# Altium project UZ_D_Inverter_Template.PrjPCB
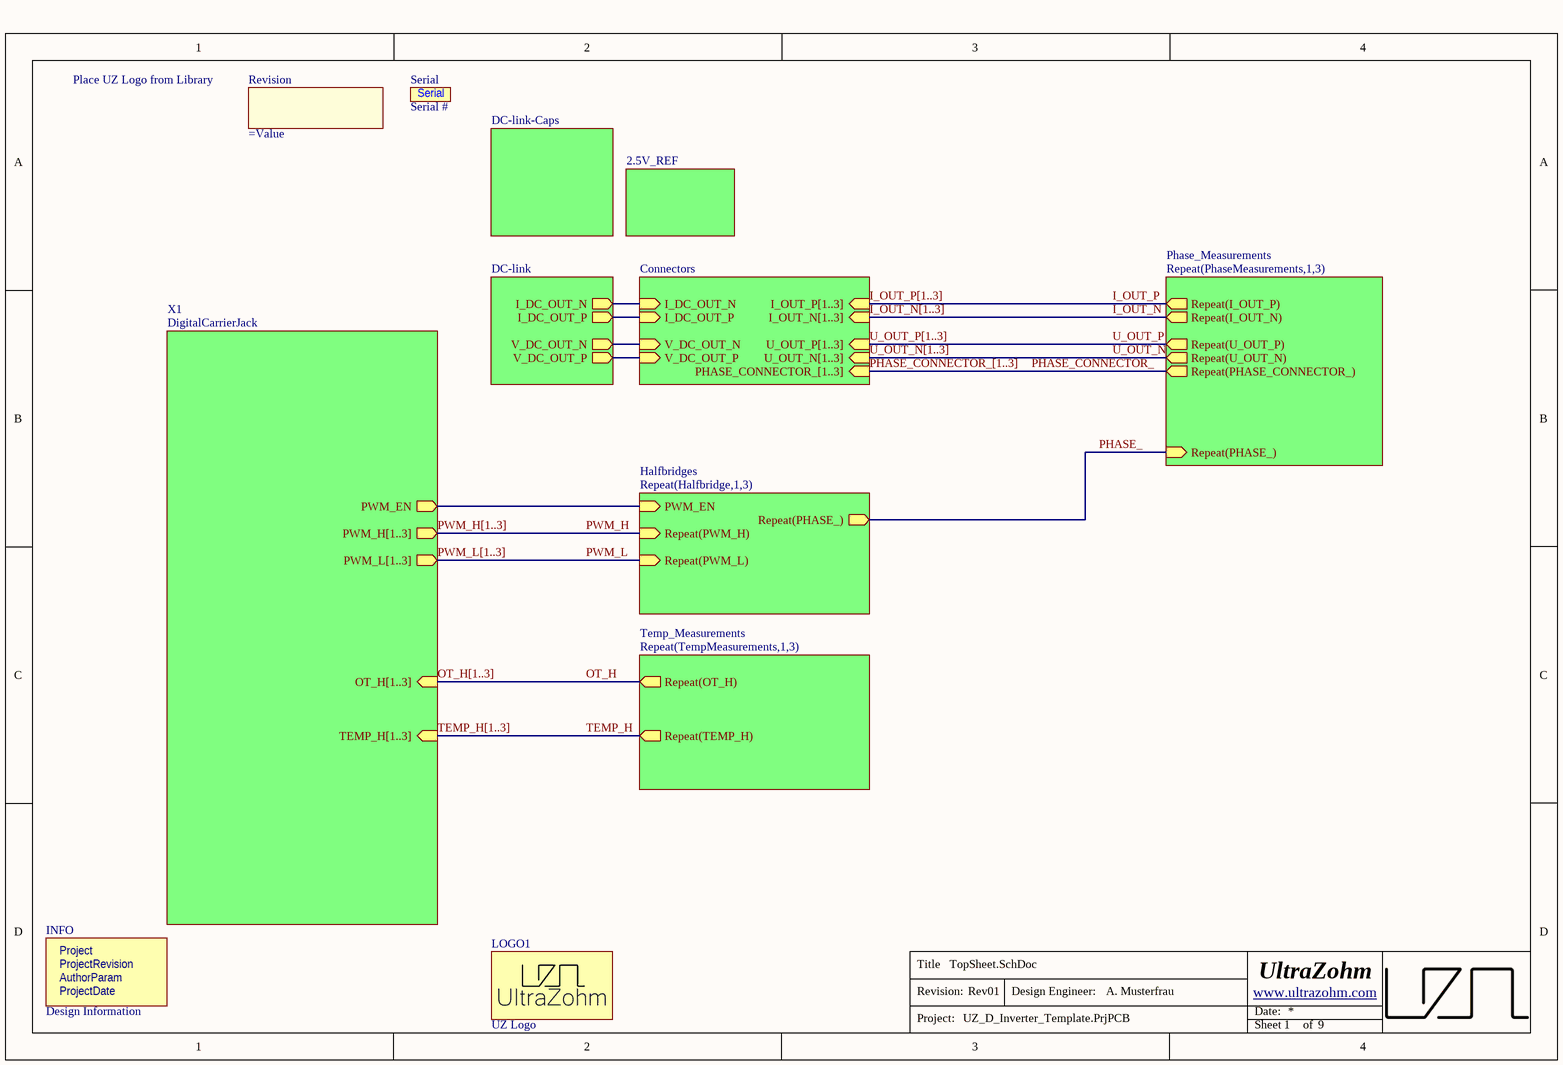
[diagram p0: TopSheet.SchDoc]
Author: A. Musterfrau; AuthorParam: A. Musterfrau; Date: 11/2019; ProjectNameCustom: UZ_D_Inverter_Template; ProjectRevision: Rev01
3 sheets, 45 parts. Net scope: hierarchical (ports join the sheet entries above them; power ports are global).
Board file: UZ_D_Inverter_Template.PcbDoc
Sheets:
  TopSheet.SchDoc
    X1 = DigitalCarrierJack.SchDoc
     = Connectors.SchDoc

## Sheet TopSheet.SchDoc
size A4; Author: A. Musterfrau; CompanyName: Technische Hochschule Nürnberg Georg Simon Ohm; Organization: UltraZohm; Address1: Kesslerplatz 12; Address2: 90489 Nürnberg; Address3: GERMANY; SheetNumber: 1; SheetTotal: 9; Website: www.ultrazohm.com

### Parts
INFO  Design Information  [Design_info]  (no BOM)
LOGO1  UZ Logo  [UZ_Logo_small]  (no BOM)
Revision  (no value)  [Designator:comment]  (no BOM)
Serial  Serial #  [SERIAL]  (no BOM)

### Sub-sheets
2.5V_REF = 2.5V_REF (file not in this document): no entries
Repeat(Halfbridge,1,3) = Halfbridges (file not in this document): Repeat(PWM_H) (in), Repeat(PWM_L) (in), Repeat(PHASE_) (out), PWM_EN (in)
Repeat(PhaseMeasurements,1,3) = Phase_Measurements (file not in this document): Repeat(I_OUT_P) (out), Repeat(I_OUT_N) (out), Repeat(U_OUT_P) (out), Repeat(U_OUT_N) (out), Repeat(PHASE_CONNECTOR_) (out), Repeat(PHASE_) (in)
Repeat(TempMeasurements,1,3) = Temp_Measurements (file not in this document): Repeat(OT_H) (out), Repeat(TEMP_H) (out)
X1 = DigitalCarrierJack: PWM_H[1..3] (out), PWM_L[1..3] (out), OT_H[1..3] (in), TEMP_H[1..3] (in), PWM_EN (out)
? = Connectors: I_DC_OUT_N (in), I_DC_OUT_P (in), I_OUT_P[1..3] (in), I_OUT_N[1..3] (in), U_OUT_P[1..3] (in), U_OUT_N[1..3] (in), V_DC_OUT_N (in), V_DC_OUT_P (in), PHASE_CONNECTOR_[1..3] (in)
? = DC-link (file not in this document): I_DC_OUT_N (out), I_DC_OUT_P (out), V_DC_OUT_N (out), V_DC_OUT_P (out)
? = DC-link-Caps (file not in this document): no entries

### Nets
I_DC_OUT_N: sheet /I_DC_OUT_N, sheet /I_DC_OUT_N
I_DC_OUT_P: sheet /I_DC_OUT_P, sheet /I_DC_OUT_P
I_OUT_N: sheet Repeat(PhaseMeasurements,1,3)/Repeat(I_OUT_N)
I_OUT_P: sheet Repeat(PhaseMeasurements,1,3)/Repeat(I_OUT_P)
OT_H: sheet Repeat(TempMeasurements,1,3)/Repeat(OT_H)
PHASE_: sheet Repeat(PhaseMeasurements,1,3)/Repeat(PHASE_), sheet Repeat(Halfbridge,1,3)/Repeat(PHASE_)
PHASE_CONNECTOR_: sheet Repeat(PhaseMeasurements,1,3)/Repeat(PHASE_CONNECTOR_)
PWM_EN: sheet X1/PWM_EN, sheet Repeat(Halfbridge,1,3)/PWM_EN
PWM_H: sheet Repeat(Halfbridge,1,3)/Repeat(PWM_H)
PWM_L: sheet Repeat(Halfbridge,1,3)/Repeat(PWM_L)
TEMP_H: sheet Repeat(TempMeasurements,1,3)/Repeat(TEMP_H)
U_OUT_N: sheet Repeat(PhaseMeasurements,1,3)/Repeat(U_OUT_N)
U_OUT_P: sheet Repeat(PhaseMeasurements,1,3)/Repeat(U_OUT_P)
V_DC_OUT_N: sheet /V_DC_OUT_N, sheet /V_DC_OUT_N
V_DC_OUT_P: sheet /V_DC_OUT_P, sheet /V_DC_OUT_P

### Buses and harness runs
bus I_OUT_N[1..3] = sheet /I_OUT_N[1..3]
bus I_OUT_P[1..3] = sheet /I_OUT_P[1..3]
bus OT_H[1..3] = sheet X1/OT_H[1..3]
bus PHASE_CONNECTOR_[1..3] = sheet /PHASE_CONNECTOR_[1..3]
bus PWM_H[1..3] = sheet X1/PWM_H[1..3]
bus PWM_L[1..3] = sheet X1/PWM_L[1..3]
bus TEMP_H[1..3] = sheet X1/TEMP_H[1..3]
bus U_OUT_N[1..3] = sheet /U_OUT_N[1..3]
bus U_OUT_P[1..3] = sheet /U_OUT_P[1..3]

### Notes on the sheet
- (near Revision) Place UZ Logo from Library
- Title
- Revision:
- Design Engineer:
- Date:
- Project:
- Sheet
- of
- (in symbol Design Information) Project; ProjectRevision; AuthorParam; ProjectDate

### Library data of the parts
INFO = Design Information: Manufacturer: UltraZohm; Created from: MGremer; Manufacturer Part Number: Design Information; PartID: 12; Created On: 03.11.2021 09:04:23; ComponentLink1Description: https://docs.ultrazohm.com/; ComponentLink1URL: homepage; Component Type: Design Information; Last Updated: 03.11.2021 09:28:34; Supplier 1: -; Supplier Part Number 1: -; Type: Design Information; Value: Design Information; Live Cycle Status: 1
LOGO1 = Logo small: Manufacturer: UltraZohm; Created from: MGremer; Created: Jan2021_Liegmann; Value: Logo; Manufacturer Part Number: Logo small; PartID: 10; Created On: 03.11.2021 09:04:23; ComponentLink1Description: https://docs.ultrazohm.com/; ComponentLink1URL: homepage; Component Type: Logo; Last Updated: 03.11.2021 09:05:50; Supplier 1: -; Supplier Part Number 1: -; Type: Logo; Live Cycle Status: 1
Revision = ProjectRevision: Value: Rev01; Created: 2020-01-08_Thilo_Wendt
Serial = SerialNumber: Empty serial number of the PCB. Can be used for manually writing the serial number

## Sheet DigitalCarrierJack.SchDoc
size A4; Author: A. Musterfrau; CompanyName: Technische Hochschule Nürnberg Georg Simon Ohm; Organization: UltraZohm; Address1: Kesslerplatz 12; Address2: 90489 Nürnberg; Address3: GERMANY; SheetNumber: 2; SheetTotal: 9; Website: www.ultrazohm.com
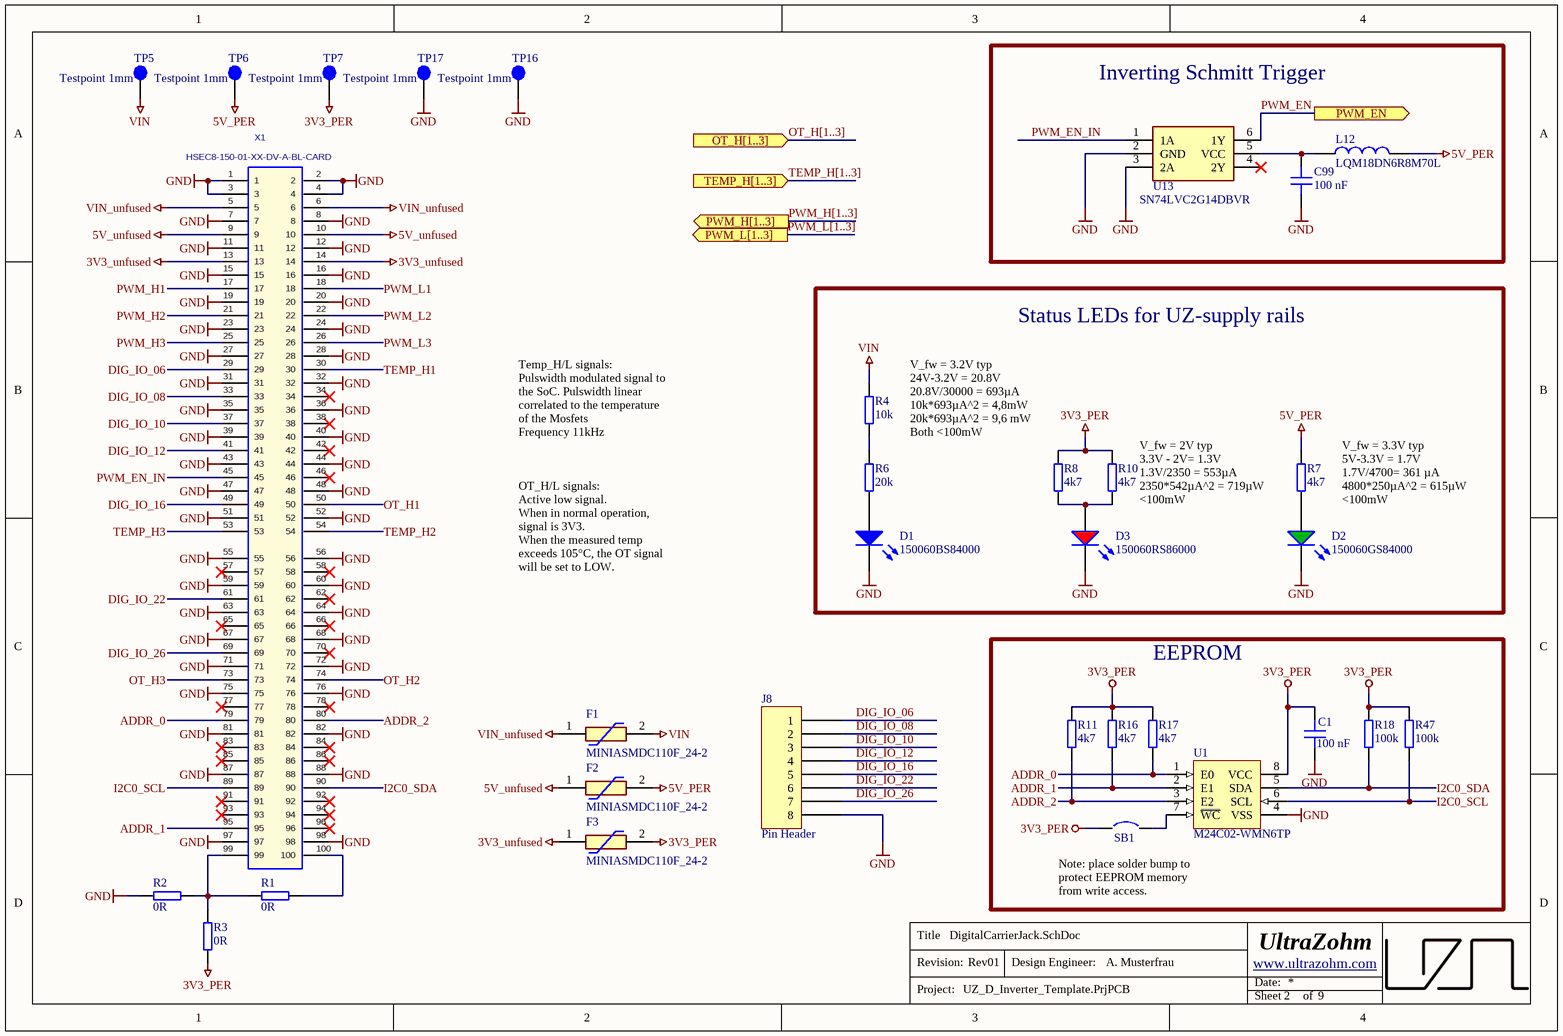
[diagram p1: DigitalCarrierJack.SchDoc]

### Parts
C1  100 nF  [C_0603]
C99  100 nF  [C_0603]
D1  150060BS84000  [WL-SMCW_0603]
D2  150060GS84000  [WL-SMCW_0603]
D3  150060RS86000  [WL-SMCW_0603]
F1  MINIASMDC110F_24-2  [MINIASMDC260F162]
F2  MINIASMDC110F_24-2  [MINIASMDC260F162]
F3  MINIASMDC110F_24-2  [MINIASMDC260F162]
J8  Pin Header  [HDR1X8]
L12  LQM18DN6R8M70L  [INDC1608X95N]
R1  0R  [RES 0603_1608]
R2  0R  [RES 0603_1608]
R3  0R  [RES 0603_1608]
R4  10k  [RES 0603_1608]
R6  20k  [RES 0603_1608]
R7  4k7  [RES 0603_1608]
R8  4k7  [RES 0603_1608]
R10  4k7  [RES 0603_1608]
R11  4k7  [RES 0603_1608]
R16  4k7  [RES 0603_1608]
R17  4k7  [RES 0603_1608]
R18  100k  [RES 0603_1608]
R47  100k  [RES 0603_1608]
SB1  Solder Bump 0603  [SB_0603]  (value not drawn)  (no BOM)
TP5  Testpoint 1mm  [TP_1mm]  (no BOM)
TP6  Testpoint 1mm  [TP_1mm]  (no BOM)
TP7  Testpoint 1mm  [TP_1mm]  (no BOM)
TP16  Testpoint 1mm  [TP_1mm]  (no BOM)
TP17  Testpoint 1mm  [TP_1mm]  (no BOM)
U1  M24C02-WMN6TP  [D0008A_N]
U13  SN74LVC2G14DBVR  [SOT95P280X145-6N]
X1  HSEC8-150-01-XX-DV-A-BL-CARD  [HSEC8-150-01-XX-DV-A-BL-CARD]  (no BOM)

### Blocks framed on the sheet
Inverting Schmitt Trigger: C99 L12 U13
Status LEDs for UZ-supply rails: D1-D3 R4 R6-R8 R10
EEPROM: C1 R11 R16-R18 R47 SB1 U1

### Ports
OT_H[1..3] (in), PWM_EN (out), PWM_H[1..3] (out), PWM_L[1..3] (out), TEMP_H[1..3] (in)

### Nets
3V3_PER: C1.1 F3.2 R3.1 R8.2 R10.2 R11.2 R16.2 R17.2 R18.2 R47.2 SB1.1 TP7.1 U1.8(VCC)
3V3_unfused: F3.1 X1.13 X1.14
5V_PER: F2.2 L12.2 R7.2 TP6.1
5V_unfused: F2.1 X1.9 X1.10
GND: C1.2 C99.1 D1.1(K) D2.1(K) D3.1(K) J8.8 R2.1 TP16.1 TP17.1 U1.4(VSS) U13.2(GND) U13.3(2A) X1.1 X1.2 X1.3 X1.4 X1.7 X1.8 X1.11 X1.12 X1.15 X1.16 X1.19 X1.20 X1.23 X1.24 X1.27 X1.28 X1.31 X1.32 X1.35 X1.36 X1.39 X1.40 X1.43 X1.44 X1.47 X1.48 X1.51 X1.52 X1.55 X1.56 X1.59 X1.60 X1.63 X1.64 X1.67 X1.68 X1.71 X1.72 X1.75 X1.76 X1.81 X1.82 X1.87 X1.88 X1.97 X1.98
VIN: F1.2 R4.2 TP5.1
VIN_unfused: F1.1 X1.5 X1.6
ADDR_0: R17.1 U1.1(E0) X1.79
ADDR_1: R16.1 U1.2(E1) X1.95
ADDR_2: R11.1 U1.3(E2) X1.80
DIG_IO_06: J8.1 X1.29
DIG_IO_08: J8.2 X1.33
DIG_IO_10: J8.3 X1.37
DIG_IO_12: J8.4 X1.41
DIG_IO_16: J8.5 X1.49
DIG_IO_22: J8.6 X1.61
DIG_IO_26: J8.7 X1.69
I2C0_SCL: R47.1 U1.6(SCL) X1.89
I2C0_SDA: R18.1 U1.5(SDA) X1.90
OT_H1: X1.50
OT_H2: X1.74
OT_H3: X1.73
PWM_EN: U13.6(1Y) ; port PWM_EN
PWM_EN_IN: U13.1(1A) X1.45
PWM_H1: X1.17
PWM_H2: X1.21
PWM_H3: X1.25
PWM_L1: X1.18
PWM_L2: X1.22
PWM_L3: X1.26
TEMP_H1: X1.30
TEMP_H2: X1.54
TEMP_H3: X1.53
NetC99_2: C99.2 L12.1 U13.5(VCC)
NetD1_2: D1.2(A) R6.1
NetD2_2: D2.2(A) R7.1
NetD3_2: D3.2(A) R8.1 R10.1
NetR1_1: R1.1 R2.2 R3.2 X1.99
NetR1_2: R1.2 X1.100
NetR4_1: R4.1 R6.2
NetSB1_2: SB1.2 U1.7(~{WC})

Not connected (* = marked no-connect by the designer): U13 4(2Y)*; X1 34* 38* 42* 46* 57* 58* 62* 65* 66* 70* 77* 78* 83* 84* 85* 86* 91* 92* 93* 94* 96*

### Buses and harness runs
bus OT_H[1..3] = port OT_H[1..3]
bus PWM_H[1..3] = port PWM_H[1..3]
bus PWM_L[1..3] = port PWM_L[1..3]
bus TEMP_H[1..3] = port TEMP_H[1..3]

### Notes on the sheet
- V_fw = 3.2V typ
  24V-3.2V = 20.8V
  20.8V/30000 = 693µA
  10k*693µA^2 = 4,8mW
  20k*693µA^2 = 9,6 mW
  Both <100mW
- Temp_H/L signals:
  Pulswidth modulated signal to the SoC. Pulswidth linear correlated to the temperature of the Mosfets
  Frequency 11kHz
- V_fw = 2V typ
  3.3V - 2V= 1.3V
  1.3V/2350 = 553µA
  2350*542µA^2 = 719µW
  <100mW
- V_fw = 3.3V typ
  5V-3.3V = 1.7V
  1.7V/4700= 361 µA
  4800*250µA^2 = 615µW
  <100mW
- OT_H/L signals:
  Active low signal.
  When in normal operation, signal is 3V3.
  When the measured temp exceeds 105°C, the OT signal will be set to LOW.
- Note: place solder bump to protect EEPROM memory from write access.
- Title
- Revision:
- Design Engineer:
- Date:
- Project:
- Sheet
- of

### Library data of the parts
C1 C99 = C1608X7S2A104KT000N: 100V 100nF X7S ±10% 0603 Multilayer Ceramic Capacitors MLCC - SMD/SMT ROHS; Manufacturer: TDK; Voltage Rating: 100 VDC; Created from: AGeiger; Manufacturer Part Number: C1608X7S2A104KT000N; PartID: 148; Created On: 20.12.2020 13:54:13; ComponentLink1Description: Datasheet; ComponentLink1URL: https://datasheet.lcsc.com/lcsc/2304140030_TDK-C1608X7S2A104KT000N_C343025.pdf; Component Type: Capacitor 0603; Device Package: 0603; Last Updated: 14.12.2022 12:14:21; Mounting Type: SMD; Operating Temperature: -55 to 125°C; Series: X7R; Supplier 1: LCSC; Supplier Part Number 1: C343025; Type: Capacitor; Tolerance: 10 %; Value: 100 nF; Live Cycle Status: 1; Stock number: not stored; LCSC Part Number: C343025
D1 = 150060BS84000: WL-SMCW SMD Mono-color Chip LED Waterclear Blue; Manufacturer: Wuerth Elektronik; Type: Standard; Created from: MGremer; Forward Current I_f: 20 mA; Forward Voltage U_f: 3.2 V; Wavelength: 470 nm; Light Intensity: 560 mcd; Nominal Power: 78 mW; Manufacturer Part Number: 150060BS84000; PartID: 1; Created On: 08.12.2020 10:19:38; ComponentLink1Description: Datasheet; ComponentLink1URL: https://www.mouser.de/datasheet/2/445/150060BS84000-1838909.pdf; Component Type: LED Diode; Device Package: 0603; Last Updated: 21.02.2024 14:46:49; Mounting Type: SMD; Operating Temperature: -40 - 85 °C; Supplier 1: Mouser; Supplier Part Number 1: 710-150060BS84000; Supplier 2: Farnell; Supplier Part Number 2: 3408611; Supplier 3: Digi-Key; Supplier Part Number 3: 732-150060BS84000CT-ND; Live Cycle Status: 1; Stock number: not stored; Color: blue; LCSC Part Number: C5197644
D2 = 150060GS84000: WL-SMCW SMD Mono-color Chip LED Waterclear Green; Manufacturer: Wuerth Elektronik; Type: Standard; Created from: MGremer; Forward Current I_f: 20 mA; Forward Voltage U_f: 3.2 V; Wavelength: 525 nm; Light Intensity: 3000 mcd; Nominal Power: 78 mW; Manufacturer Part Number: 150060GS84000; PartID: 2; Created On: 08.12.2020 10:41:11; ComponentLink1Description: Datasheet; ComponentLink1URL: https://www.mouser.de/datasheet/2/445/150060GS75020-1714345.pdf; Component Type: LED Diode; Device Package: 0603; Last Updated: 25.01.2024 19:29:32; Mounting Type: SMD; Operating Temperature: -40 - 85 °C; Supplier 1: Mouser; Supplier Part Number 1: 710-150060GS84000; Supplier 2: Farnell; Supplier Part Number 2: 3408612; Supplier 3: Digi-Key; Supplier Part Number 3: 732-150060GS84000CT-ND; Live Cycle Status: 1; Stock number: not stored; Color: green; LCSC Part Number: C84267
D3 = 150060RS86000: WL-SMCW SMD Mono-color Chip LED Waterclear Red; Manufacturer: Wuerth Elektronik; Type: Standard; Created from: MGremer; Forward Current I_f: 20 mA; Forward Voltage U_f: 2 V; Wavelength: 624 nm; Light Intensity: 800 mcd; Nominal Power: 48 mW; Manufacturer Part Number: 150060RS86000; PartID: 3; Created On: 08.12.2020 10:48:12; ComponentLink1Description: Datasheet; ComponentLink1URL: https://www.mouser.de/datasheet/2/445/150120RS75000-1714636.pdf; Component Type: LED Diode; Device Package: 0603; Last Updated: 15.02.2023 18:12:03; Mounting Type: SMD; Operating Temperature: -40 - 85 °C; Supplier 1: Mouser; Supplier Part Number 1: 710-150060RS86000; Supplier 2: Farnell; Supplier Part Number 2: 3408608; Supplier 3: Digi-Key; Supplier Part Number 3: 732-150060RS86000CT-ND; Live Cycle Status: 1; Stock number: not stored; Color: red; LCSC Part Number: C389517
F1-F3 = MINIASMDC110F/24-2: POLYSWITCH RESETTABLE DEVICES; Manufacturer_Name: LITTELFUSE; Type: Fuse; Nominal current: 1.1 A; Nominal voltage DC: 24 VDC; Resistance: 180 mOhm; Value: PPTC, 1.1 A, 24V; Created from: DHufnagel; Datasheet Link: https://www.littelfuse.com/~/media/electronics/datasheets/resettable_ptcs/littelfuse_ptc_miniasmdc_datasheet.pdf.pdf; Height: 0.89mm; Manufacturer_Part_Number: MINIASMDC110F/24-2; Mouser Part Number: 650-MINIASMDC110F/24; Mouser Price/Stock: https://www.mouser.com/Search/Refine.aspx?Keyword=650-MINIASMDC110F%2F24; Arrow Part Number: MINIASMDC110F/24-2; Arrow Price/Stock: https://www.arrow.com/en/products/miniasmdc110f24-2/littelfuse; Manufacturer Part Number: MINIASMDC110F/24-2; PartID: 6; Created On: 20.12.2022 08:41:46; ComponentLink1Description: Datasheet; ComponentLink1URL: https://www.mouser.de/datasheet/2/240/Littelfuse_PTC_Surface_Mount_Catalog_Datasheet_pdf-2999493.pdf; Component Type: Littlefuse_PPTC_1812; Last Updated: 21.02.2024 14:55:35; Manufacturer: Littelfuse; Mounting Type: SMD; Operating Temperature: -40 - 85 °C; Supplier 1: Mouser; Supplier Part Number 1: 650-MINIASMDC110F/24; Live Cycle Status: 1; Stock number: not stored; Device Package: 1812; Supplier 2: LCSC; Supplier Part Number 2: C70119; LCSC Part Number: C70119
J8 = 103741-8: 8 Pin; Manufacturer: TE Connectivity; Created from: MHlatky; Manufacturer Part Number: 103741-8; PartID: 9; Created On: 22.11.2021 15:31:45; ComponentLink1Description: Datasheet; ComponentLink1URL: https://www.mouser.de/datasheet/2/427/VISH_S_A0003529023_1-2568887.pdf; Component Type: Pin Header; Last Updated: 21.03.2022 12:19:22; Supplier 1: Mouser; Supplier Part Number 1: 571-103741-8; Type: Pin Header; Live Cycle Status: 1; Stock number: not stored
L12 = LQM18DN6R8M70L: 6.8µH, 120mA, 0603, 740mOhm, 20%; Manufacturer: Murata; MF: EPCOS / TDK; Value: 6.8uH; DCR: 320m; Rated Current: 0.85 A; Type: fixed inductor; Created from: DHufnagel; MPN: B82464G4154M; Supplier 1: Mouser; Supplier Part Number 1: 81-LQM18DN6R8M70L; Manufacturer Part Number: LQM18DN6R8M70L; PartID: 10; Created On: 19.07.2022 15:47:17; ComponentLink1Description: Datasheet; ComponentLink1URL: https://www.mouser.de/datasheet/2/281/1/JELF243B_0086-2298241.pdf; Component Type: SMD fixed inductor; Device Package: SMD; Last Updated: 15.06.2023 16:03:16; Mounting Type: SMD; Operating Temperature: -40 - 125°C; Series: LQM18DN_70; Supplier 2: Digi-Key; Supplier Part Number 2: 490-LQM18DN6R8M70LCT-ND; DC current: 120mA; Live Cycle Status: 1; Stock number: not stored; LCSC Part Number: C1881372
R1-R3 = RC0603JR-070RL: SMD resistor E24 series; Manufacturer: YAGEO; Tolerance: 5%; Created from: MGremer; Manufacturer Part Number: RC0603JR-070RL; PartID: 1; Created On: 14.12.2020 16:17:14; ComponentLink1Description: Datasheet; ComponentLink1URL: https://www.mouser.de/datasheet/2/447/PYu-RC_Group_51_RoHS_L_10-1664068.pdf; Component Type: SMD resistor; Device Package: 0603; Last Updated: 04.03.2021 09:09:42; Mounting Type: SMD; Supplier 1: Mouser; Supplier Part Number 1: 603-RC0603JR-070RL; Supplier 2: LCSC; Supplier Part Number 2: C21189; Type: Resistor; Value: 0R; Live Cycle Status: 1; Stock number: Labor SMD Container; LCSC Part Number: C21189
R4 = RK73B1JTTD103J: SMD resistor E24 series; Manufacturer: KOA Speer; Tolerance: 5%; Created from: MGremer; Manufacturer Part Number: RK73B1JTTD103J; PartID: 98; Created On: 14.12.2020 16:17:14; ComponentLink1Description: Datasheet; ComponentLink1URL: https://www.mouser.de/datasheet/2/219/RK73B-1825463.pdf; Component Type: SMD resistor; Device Package: 0603; Last Updated: 27.05.2022 14:04:22; Mounting Type: SMD; Supplier 1: Mouser; Supplier Part Number 1: 660-RK73B1JTTD103J; Type: Resistor; Value: 10k; Live Cycle Status: 1; Stock number: Labor SMD Container; LCSC Part Number: C25804
R6 = RK73B1JTTD203J: SMD resistor E24 series; Manufacturer: KOA Speer; Tolerance: 1%; Created from: DHufnagel; Manufacturer Part Number: RK73B1JTTD203J; PartID: 262; Created On: 17.04.2023 08:13:36; ComponentLink1Description: Datasheet; ComponentLink1URL: https://www.mouser.de/datasheet/2/219/RK73B-1825463.pdf; Component Type: SMD resistor; Device Package: 0603; Last Updated: 21.02.2024 16:16:07; Mounting Type: SMD; Supplier 1: Mouser; Supplier Part Number 1: 660-RK73B1JTTD203J; Type: Resistor; Value: 20k; Live Cycle Status: 1; Stock number: not stored; LCSC Part Number: C4184
R7 R8 R10 R11 R16 R17 = 0603WAF4701T5E: SMD resistor E24 series; Manufacturer: UNI-ROYAL; Tolerance: 1%; Created from: AGeiger; Manufacturer Part Number: 0603WAF4701T5E; PartID: 90; Created On: 14.12.2020 16:17:14; ComponentLink1Description: Datasheet; ComponentLink1URL: https://datasheet.lcsc.com/lcsc/2206010116_UNI-ROYAL-Uniroyal-Elec-0603WAF4701T5E_C23162.pdf; Component Type: SMD resistor; Device Package: 0603; Last Updated: 25.08.2022 20:03:04; Mounting Type: SMD; Supplier 1: LCSC; Supplier Part Number 1: C23162; Type: Resistor; Value: 4k7; Live Cycle Status: 1; Stock number: Labor SMD Container; LCSC Part Number: C23162
R18 R47 = RK73B1JTTD104J: SMD resistor E24 series; Manufacturer: KOA Speer; Tolerance: 5%; Created from: MGremer; Manufacturer Part Number: RK73B1JTTD104J; PartID: 122; Created On: 14.12.2020 16:17:14; ComponentLink1Description: Datasheet; ComponentLink1URL: https://www.mouser.de/datasheet/2/219/RK73B-1825463.pdf; Component Type: SMD resistor; Device Package: 0603; Last Updated: 27.05.2022 14:04:10; Mounting Type: SMD; Supplier 1: Mouser; Supplier Part Number 1: 660-RK73B1JTTD104J; Type: Resistor; Value: 100k; Live Cycle Status: 1; Stock number: Labor SMD Container; LCSC Part Number: C25803
SB1 = =Value: Created from: AGeiger; Revision: July-2002: Re-released for DXP Platform.; PartID: 1; Created On: 09.01.2024 17:13:56; Component Type: Solder Bump; Device Package: 0603; Last Updated: 09.01.2024 17:13:56; Manufacturer Part Number: Solder Bump 0603; Mounting Type: SMD; Value: Solder Bump 0603
TP5-TP7 TP16 TP17 = NULL: Manufacturer Part Number: NULL; Created from: AGeiger; Created: 2018_06_25_AGeiger; Value: Testpoint 1mm; PartID: 9; Created On: 20.09.2022 13:14:57; Component Type: Testpoint; Last Updated: 20.09.2022 13:15:39; Manufacturer: NULL; Supplier 1: NULL; Supplier Part Number 1: NULL; Type: Testpoint; Live Cycle Status: 1
U1 = M24C02-WMN6TP: 2Kbit I2C SOP-8 EEPROM ROHS; Manufacturer: STMicroelectronics; Created from: AGeiger; Manufacturer Part Number: M24C02-WMN6TP; PartID: 1; Created On: 19.11.2023 14:54:27; ComponentLink1Description: Datasheet; ComponentLink1URL: https://www.st.com/resource/en/datasheet/m24c01-w.pdf; Component Type: EEPROM; Device Package: SOIC-8; Last Updated: 19.11.2023 21:39:04; Mounting Type: SMD; Operating Temperature: -40 to +85 °C; Series: M24xxx; Supplier 1: Mouser; Supplier Part Number 1: 511-M24C02-WMN6TP; Supplier 2: LCSC; Supplier Part Number 2: C7562; Type: Memory; Value: M24C02-WMN6TP; LCSC Part Number: C7562
U13 = SN74LVC2G14DBVR: Dual Schmitt Trigger Inverter; Manufacturer: Texas Instruments; Created from: MGremer; Manufacturer Part Number: SN74LVC2G14DBVR; PartID: 12; Created On: 08.11.2021 12:38:27; ComponentLink1Description: Datasheet; ComponentLink1URL: https://www.ti.com/lit/ds/symlink/sn74lvc2g14.pdf; Component Type: Inverter; Device Package: SOT-23-6; Last Updated: 21.02.2024 16:28:38; Mounting Type: SMD; Operating Temperature: -40 - 125 °C; Series: SN74LVC2G14; Supplier 1: Mouser; Supplier Part Number 1: 595-SN74LVC2G14DBVR; Type: Inverter; Live Cycle Status: 1; LCSC Part Number: C12401; Stock number: not stored
X1 = HSEC8-150-01-XX-DV-A-BL-CARD: Mating Card Layout for HSEC8-150-01-XX-DV-A-BL; Manufacturer: SAMTEC; Created: 2018_04_23_AGeiger; Value: HSEC8-150-01-XX-DV-A-BL-CARD

## Sheet Connectors.SchDoc
size A4; Author: A. Musterfrau; CompanyName: Technische Hochschule Nürnberg Georg Simon Ohm; Organization: UltraZohm; Address1: Kesslerplatz 12; Address2: 90489 Nürnberg; Address3: GERMANY; SheetNumber: 3; SheetTotal: 9; Website: www.ultrazohm.com
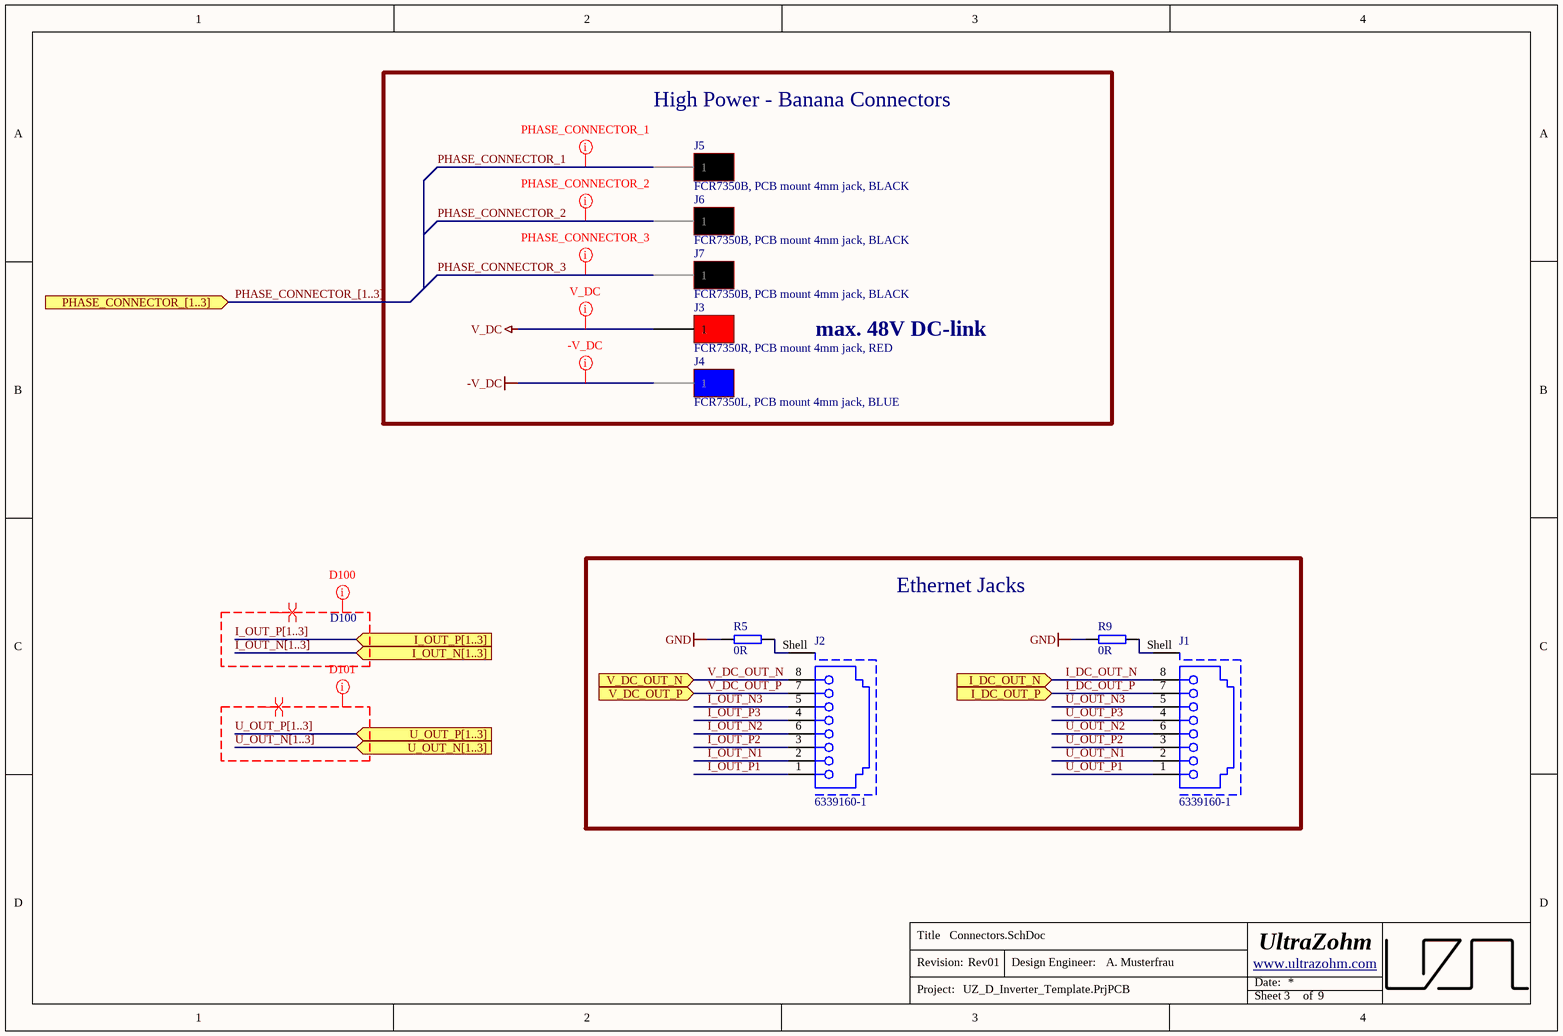
[diagram p2: Connectors.SchDoc]

### Parts
J1  6339160-1  [634008149821]
J2  6339160-1  [634008149821]
J3  FCR7350R, PCB mount 4mm jack, RED  [FCR7350]
J4  FCR7350L, PCB mount 4mm jack, BLUE  [FCR7350]
J5  FCR7350B, PCB mount 4mm jack, BLACK  [FCR7350]
J6  FCR7350B, PCB mount 4mm jack, BLACK  [FCR7350]
J7  FCR7350B, PCB mount 4mm jack, BLACK  [FCR7350]
R5  0R  [RES 0603_1608]
R9  0R  [RES 0603_1608]

### Blocks framed on the sheet
Ethernet Jacks: J1 J2 R5 R9

### Ports
I_DC_OUT_N (in), I_DC_OUT_P (in), I_OUT_N[1..3] (in), I_OUT_P[1..3] (in), PHASE_CONNECTOR_[1..3] (in), U_OUT_N[1..3] (in), U_OUT_P[1..3] (in), V_DC_OUT_N (in), V_DC_OUT_P (in)

### Nets
-V_DC: J4.1
GND: R5.1 R9.1
V_DC: J3.1
I_DC_OUT_N: J1.8 ; port I_DC_OUT_N
I_DC_OUT_P: J1.7 ; port I_DC_OUT_P
I_OUT_N1: J2.2
I_OUT_N2: J2.6
I_OUT_N3: J2.5
I_OUT_P1: J2.1
I_OUT_P2: J2.3
I_OUT_P3: J2.4
PHASE_CONNECTOR_1: J5.1
PHASE_CONNECTOR_2: J6.1
PHASE_CONNECTOR_3: J7.1
U_OUT_N1: J1.2
U_OUT_N2: J1.6
U_OUT_N3: J1.5
U_OUT_P1: J1.1
U_OUT_P2: J1.3
U_OUT_P3: J1.4
V_DC_OUT_N: J2.8 ; port V_DC_OUT_N
V_DC_OUT_P: J2.7 ; port V_DC_OUT_P
NetJ1_Shell: J1.Shell R9.2
NetJ2_Shell: J2.Shell R5.2

### Buses and harness runs
bus I_OUT_N[1..3] = port I_OUT_N[1..3]
bus I_OUT_P[1..3] = port I_OUT_P[1..3]
bus PHASE_CONNECTOR_[1..3] = port PHASE_CONNECTOR_[1..3]
bus U_OUT_N[1..3] = port U_OUT_N[1..3]
bus U_OUT_P[1..3] = port U_OUT_P[1..3]

### Layout directives
differential pair: I_OUT_N[1..3], I_OUT_P[1..3], U_OUT_N[1..3], U_OUT_P[1..3]
net class D100: I_OUT_N[1..3], I_OUT_P[1..3]
mark named D101: U_OUT_N[1..3], U_OUT_P[1..3]
net class Power: -V_DC, PHASE_CONNECTOR_1, PHASE_CONNECTOR_2, PHASE_CONNECTOR_3, V_DC

### Notes on the sheet
- High Power - Banana Connectors
- max. 48V DC-link
- Title
- Revision:
- Design Engineer:
- Date:
- Project:
- Sheet
- of

### Library data of the parts
J1 J2 = 6339160-1: RJ45 RJReceptacle cat5 Gold Phosphor bronze Without LED -40℃~+85℃ SMD Ethernet Connectors/Modular Connectors (RJ45 RJ11) ROHS; Manufacturer: TE Connectivity; Match Code: WR-MJ; Contact Resistance: 20mOhm; Insulation Resistance: 500MOhm; LED: No; Number of Ports: 1; Rated Current: 1.5A; Shielding: Yes; Working Voltage: 120VAC; Withstanding Voltage: 1000VAC; Created from: NDiringer; ComponentLink1Description: Datasheet; ComponentLink1URL: https://jlcpcb.com/partdetail/TeConnectivity-63391601/C125076; ComponentLink2Description: Datasheet; ComponentLink2URL: https://www.we-online.com/redexpert/spec/634008149821?ad; Category: Input/Output Connectors; Manufacturer Part Number: 6339160-1; Mount: Surface Mount; Operating Temperature Max: 85°C; Operating Temperature Min: -40°C; Packaging: Tray; Number of Pins: 8P8C; Orientation: Horizontal; PartID: 8; Created On: 20.04.2023 12:29:11; Component Type: RJ45 Connector; Device Package: RJ45; Last Updated: 21.02.2024 15:07:56; Mounting Type: SMD; Series: RJHSE; Supplier 1: LCSC; Supplier Part Number 1: C125076; Type: RJ45 Connector; Live Cycle Status: 1; Stock number: not stored; LCSC Part Number: C125076
J3 = FCR7350R: FCR7350B, 1000V, 24A, RED; Manufacturer: Cliff; Value: PCB mount 4mm jack, Red FCR7350R, 1000V, 24A; Created from: DHufnagel; Manufacturer Part Number: FCR7350R; PartID: 7; Created On: 13.06.2022 10:18:11; ComponentLink1Description: datasheet; ComponentLink1URL: https://www.cliffuk.co.uk/products/testleads/sockets/S16NPC.pdf; ComponentLink2Description: drawing; ComponentLink2URL: https://media.digikey.com/pdf/Data%20Sheets/Cliff%20Electronic%20LTD%20PDF's/FCR7350_Drawing.pdf; Component Type: PCB mount 4mm jack, Red; Device Package: THT; Last Updated: 21.02.2024 15:19:13; Minimum Order: 1; Mounting Type: THT; Operating Temperature: -40°C - 80°C; Series: S16N-PC; Supplier 1: Digi-Key; Supplier Part Number 1: 3185-FCR7350R-ND; Supplier 2: farnell; Supplier Part Number 2: 1854508; Type: PCB mount 4mm jack, Red FCR7350R, 1000V, 24A; Live Cycle Status: 1; Stock number: not stored; Supplier 3: LCSC; Supplier Part Number 3: C7437326; LCSC Part Number: C7437326
J4 = FCR7350L: FCR7350B, 1000V, 24A, BLUE; Manufacturer: Cliff; Value: PCB mount 4mm jack, Blue FCR7350L, 1000V, 24A; Created from: DHufnagel; Manufacturer Part Number: FCR7350L; PartID: 8; Created On: 13.06.2022 10:18:11; ComponentLink1Description: datasheet; ComponentLink1URL: https://www.cliffuk.co.uk/products/testleads/sockets/S16NPC.pdf; ComponentLink2Description: drawing; ComponentLink2URL: https://media.digikey.com/pdf/Data%20Sheets/Cliff%20Electronic%20LTD%20PDF's/FCR7350_Drawing.pdf; Component Type: PCB mount 4mm jack, Blue; Device Package: THT; Last Updated: 28.06.2022 13:58:37; Minimum Order: 1; Mounting Type: THT; Operating Temperature: -40°C - 80°C; Series: S16N-PC; Supplier 1: Digi-Key; Supplier Part Number 1: 3185-FCR7350L-ND; Supplier 2: farnell; Supplier Part Number 2: 1854511; Type: PCB mount 4mm jack, Blue FCR7350L, 1000V, 24A; Live Cycle Status: 1; Stock number: not stored; LCSC Part Number: C7190856
J5-J7 = FCR7350B: FCR7350B, 1000V, 24A, BLACK; Manufacturer: Cliff; Value: PCB mount 4mm jack, Black	FCR7350B, 1000V, 24A; Created from: DHufnagel; Manufacturer Part Number: FCR7350B; PartID: 6; Created On: 13.06.2022 10:18:11; ComponentLink1Description: datasheet; ComponentLink1URL: https://www.cliffuk.co.uk/products/testleads/sockets/S16NPC.pdf; ComponentLink2Description: drawing; ComponentLink2URL: https://media.digikey.com/pdf/Data%20Sheets/Cliff%20Electronic%20LTD%20PDF's/FCR7350_Drawing.pdf; Component Type: PCB mount 4mm jack, Black; Device Package: THT; Last Updated: 21.02.2024 15:21:29; Minimum Order: 1; Mounting Type: THT; Operating Temperature: -40°C - 80°C; Series: S16N-PC; Supplier 1: Digi-Key; Supplier Part Number 1: 3185-FCR7350B-ND; Supplier 2: farnell; Supplier Part Number 2: 1854507; Type: PCB mount 4mm jack, Black	FCR7350B, 1000V, 24A; Live Cycle Status: 1; Stock number: not stored; Supplier 3: LCSC; Supplier Part Number 3: C7437327; LCSC Part Number: C7437327
R5 R9 = RC0603JR-070RL: as R1 on sheet DigitalCarrierJack; Manufacturer Part Number: RC0603JR-070RL; PartID: 1; Created On: 14.12.2020 16:17:14; ComponentLink1Description: Datasheet; ComponentLink1URL: https://www.mouser.de/datasheet/2/447/PYu-RC_Group_51_RoHS_L_10-1664068.pdf; Component Type: SMD resistor; Device Package: 0603; Last Updated: 04.03.2021 09:09:42; Mounting Type: SMD; Supplier 1: Mouser; Supplier Part Number 1: 603-RC0603JR-070RL; Supplier 2: LCSC; Supplier Part Number 2: C21189; Type: Resistor; Value: 0R; Live Cycle Status: 1; Stock number: Labor SMD Container; LCSC Part Number: C21189

## Nets that join several sheets
GND: DigitalCarrierJack (58 pins), Connectors (R5.1 R9.1)